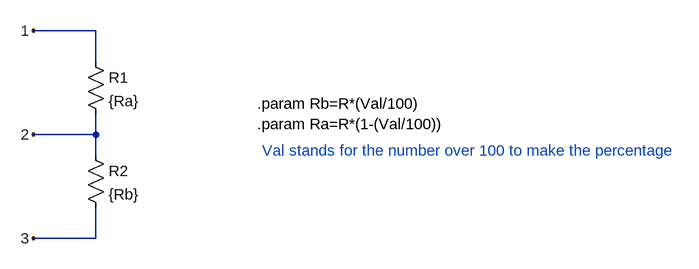
[diagram p0: schematic Potentiometer.asc]
Potentiometer.asc, the LTspice schematic file:
Version 4
SHEET 1 1128 680
WIRE 176 16 80 16
WIRE 176 64 176 16
WIRE 176 176 176 144
WIRE 176 176 80 176
WIRE 176 208 176 176
WIRE 176 336 176 288
WIRE 176 336 80 336
FLAG 80 16 1
FLAG 80 176 2
FLAG 80 336 3
SYMBOL res 160 48 R0
SYMATTR InstName R1
SYMATTR Value {Ra}
SYMBOL res 160 192 R0
SYMATTR InstName R2
SYMATTR Value {Rb}
TEXT 424 128 Left 2 !.param Rb=R*(Val/100)\n.param Ra=R*(1-(Val/100))
TEXT 432 200 Left 2 ;Val stands for the number over 100 to make the percentage

The netlist it stands for:
* Potentiometer.asc
R1 1 2 {Ra}
R2 2 3 {Rb}
.param Rb=R*(Val/100)
.param Ra=R*(1-(Val/100))
* Val stands for the number over 100 to make the percentage
.backanno
.end